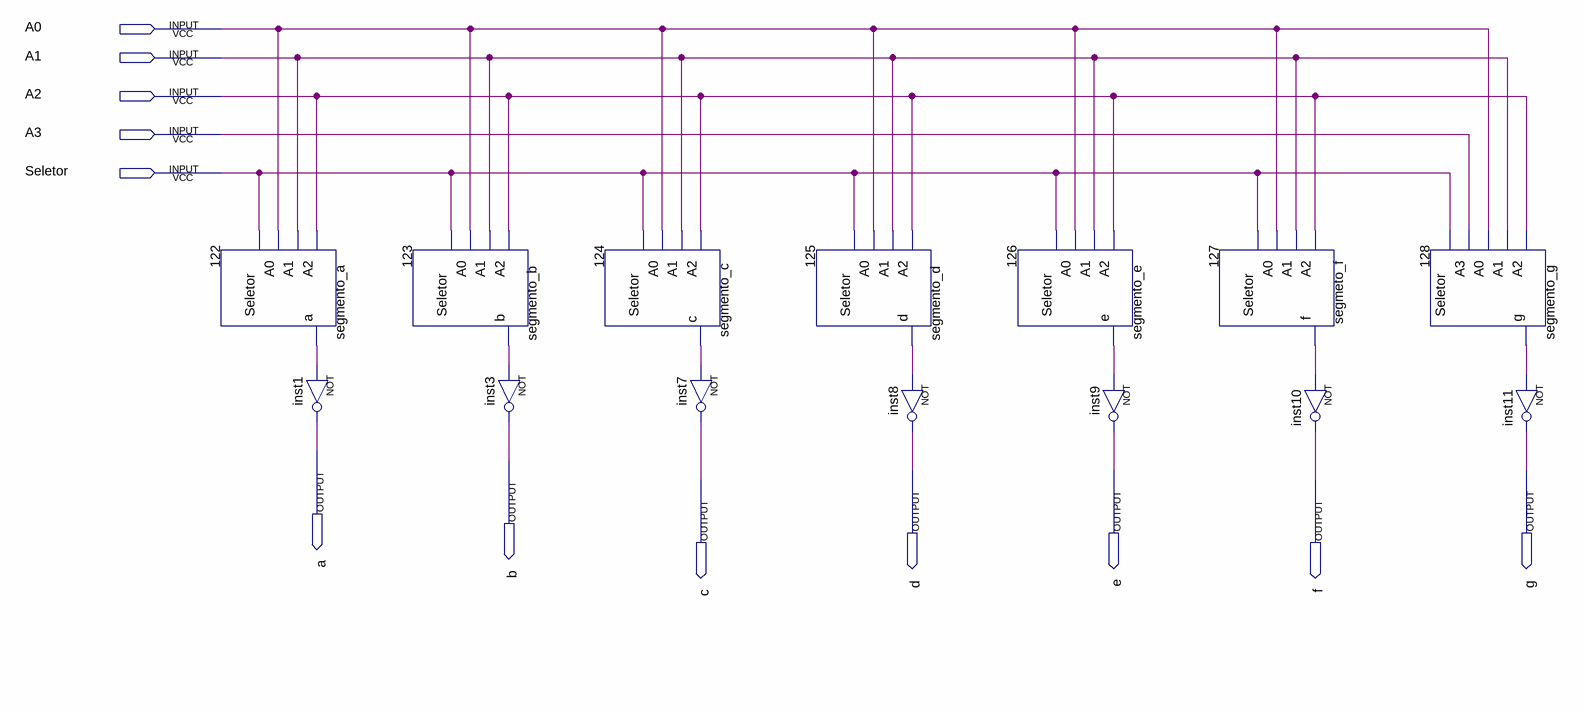
[diagram p0: schematic sheet]
// Quartus schematic Decoder_7seg.bdf as structural Verilog: 14 symbols, 12 pins
module Decoder_7seg (
  input  A0,
  input  A1,
  input  A2,
  input  A3,
  input  Seletor,
  output a,
  output b,
  output d,
  output e,
  output g,
  output c,
  output f
);

  wire n122_a, n123_b, n124_c, n125_d, n126_e, n127_f, n128_g;

  segmento_a u_122 (.A2(A2), .A1(A1), .A0(A0), .Seletor(Seletor), .a(n122_a));
  not inst1 (a, n122_a);
  segmento_b u_123 (.A2(A2), .A1(A1), .A0(A0), .Seletor(Seletor), .b(n123_b));
  not inst3 (b, n123_b);
  segmento_c u_124 (.A2(A2), .A1(A1), .A0(A0), .Seletor(Seletor), .c(n124_c));
  not inst7 (c, n124_c);
  segmento_d u_125 (.A2(A2), .A1(A1), .A0(A0), .Seletor(Seletor), .d(n125_d));
  not inst8 (d, n125_d);
  segmento_e u_126 (.A2(A2), .A1(A1), .A0(A0), .Seletor(Seletor), .e(n126_e));
  not inst9 (e, n126_e);
  segmeto_f u_127 (.A2(A2), .A1(A1), .A0(A0), .Seletor(Seletor), .f(n127_f));
  not inst10 (f, n127_f);
  segmento_g u_128 (.A2(A2), .A1(A1), .A0(A0), .A3(A3), .Seletor(Seletor), .g(n128_g));
  not inst11 (g, n128_g);
endmodule
